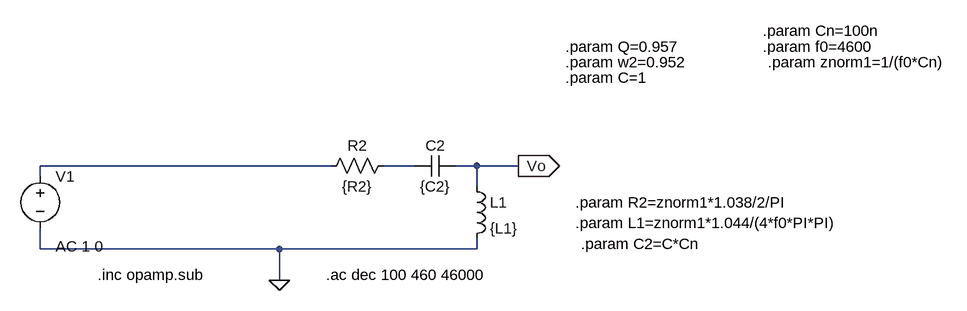
[diagram p0: schematic TPL1_Simulacion_Circuital_V1.0.asc]
TPL1_Simulacion_Circuital_V1.0.asc, the LTspice schematic file:
Version 4
SHEET 1 1328 680
WIRE 272 112 -176 112
WIRE 400 112 352 112
WIRE 496 112 464 112
WIRE 560 112 496 112
WIRE -176 128 -176 112
WIRE 496 144 496 112
WIRE -176 240 -176 208
WIRE 192 240 -176 240
WIRE 496 240 496 224
WIRE 496 240 192 240
WIRE 192 288 192 240
FLAG 192 288 0
FLAG 560 112 Vo
IOPIN 560 112 Out
SYMBOL res 368 96 R90
WINDOW 0 0 56 VBottom 2
WINDOW 3 32 56 VTop 2
SYMATTR InstName R2
SYMATTR Value {R2}
SYMBOL ind 480 128 R0
SYMATTR InstName L1
SYMATTR Value {L1}
SYMBOL cap 464 96 R90
WINDOW 0 0 32 VBottom 2
WINDOW 3 32 32 VTop 2
SYMATTR InstName C2
SYMATTR Value {C2}
SYMBOL voltage -176 112 R0
WINDOW 123 24 124 Left 2
WINDOW 39 0 0 Left 0
SYMATTR Value2 AC 1 0
SYMATTR InstName V1
SYMATTR Value ""
TEXT 264 280 Left 2 !.ac dec 100 460 46000
TEXT -88 280 Left 2 !.inc opamp.sub
TEXT 632 -48 Left 2 !.param w2=0.952
TEXT 648 200 Left 2 !.param L1=znorm1*1.044/(4*f0*PI*PI)
TEXT 648 168 Left 2 !.param R2=znorm1*1.038/2/PI
TEXT 632 -72 Left 2 !.param Q=0.957
TEXT 632 -24 Left 2 !.param C=1
TEXT 656 232 Left 2 !.param C2=C*Cn
TEXT 936 -96 Left 2 !.param Cn=100n
TEXT 936 -72 Left 2 !.param f0=4600
TEXT 944 -48 Left 2 !.param znorm1=1/(f0*Cn)

The netlist it stands for:
* TPL1_Simulacion_Circuital_V1.0.asc
R2 N002 N001 {R2}
L1 Vo 0 {L1}
C2 Vo N002 {C2}
V1 N001 0 AC 1 0
.ac dec 100 460 46000
.inc opamp.sub
.param w2=0.952
.param L1=znorm1*1.044/(4*f0*PI*PI)
.param R2=znorm1*1.038/2/PI
.param Q=0.957
.param C=1
.param C2=C*Cn
.param Cn=100n
.param f0=4600
.param znorm1=1/(f0*Cn)
.backanno
.end